# EAGLE design 5853-base-board (EAGLE 6.4)
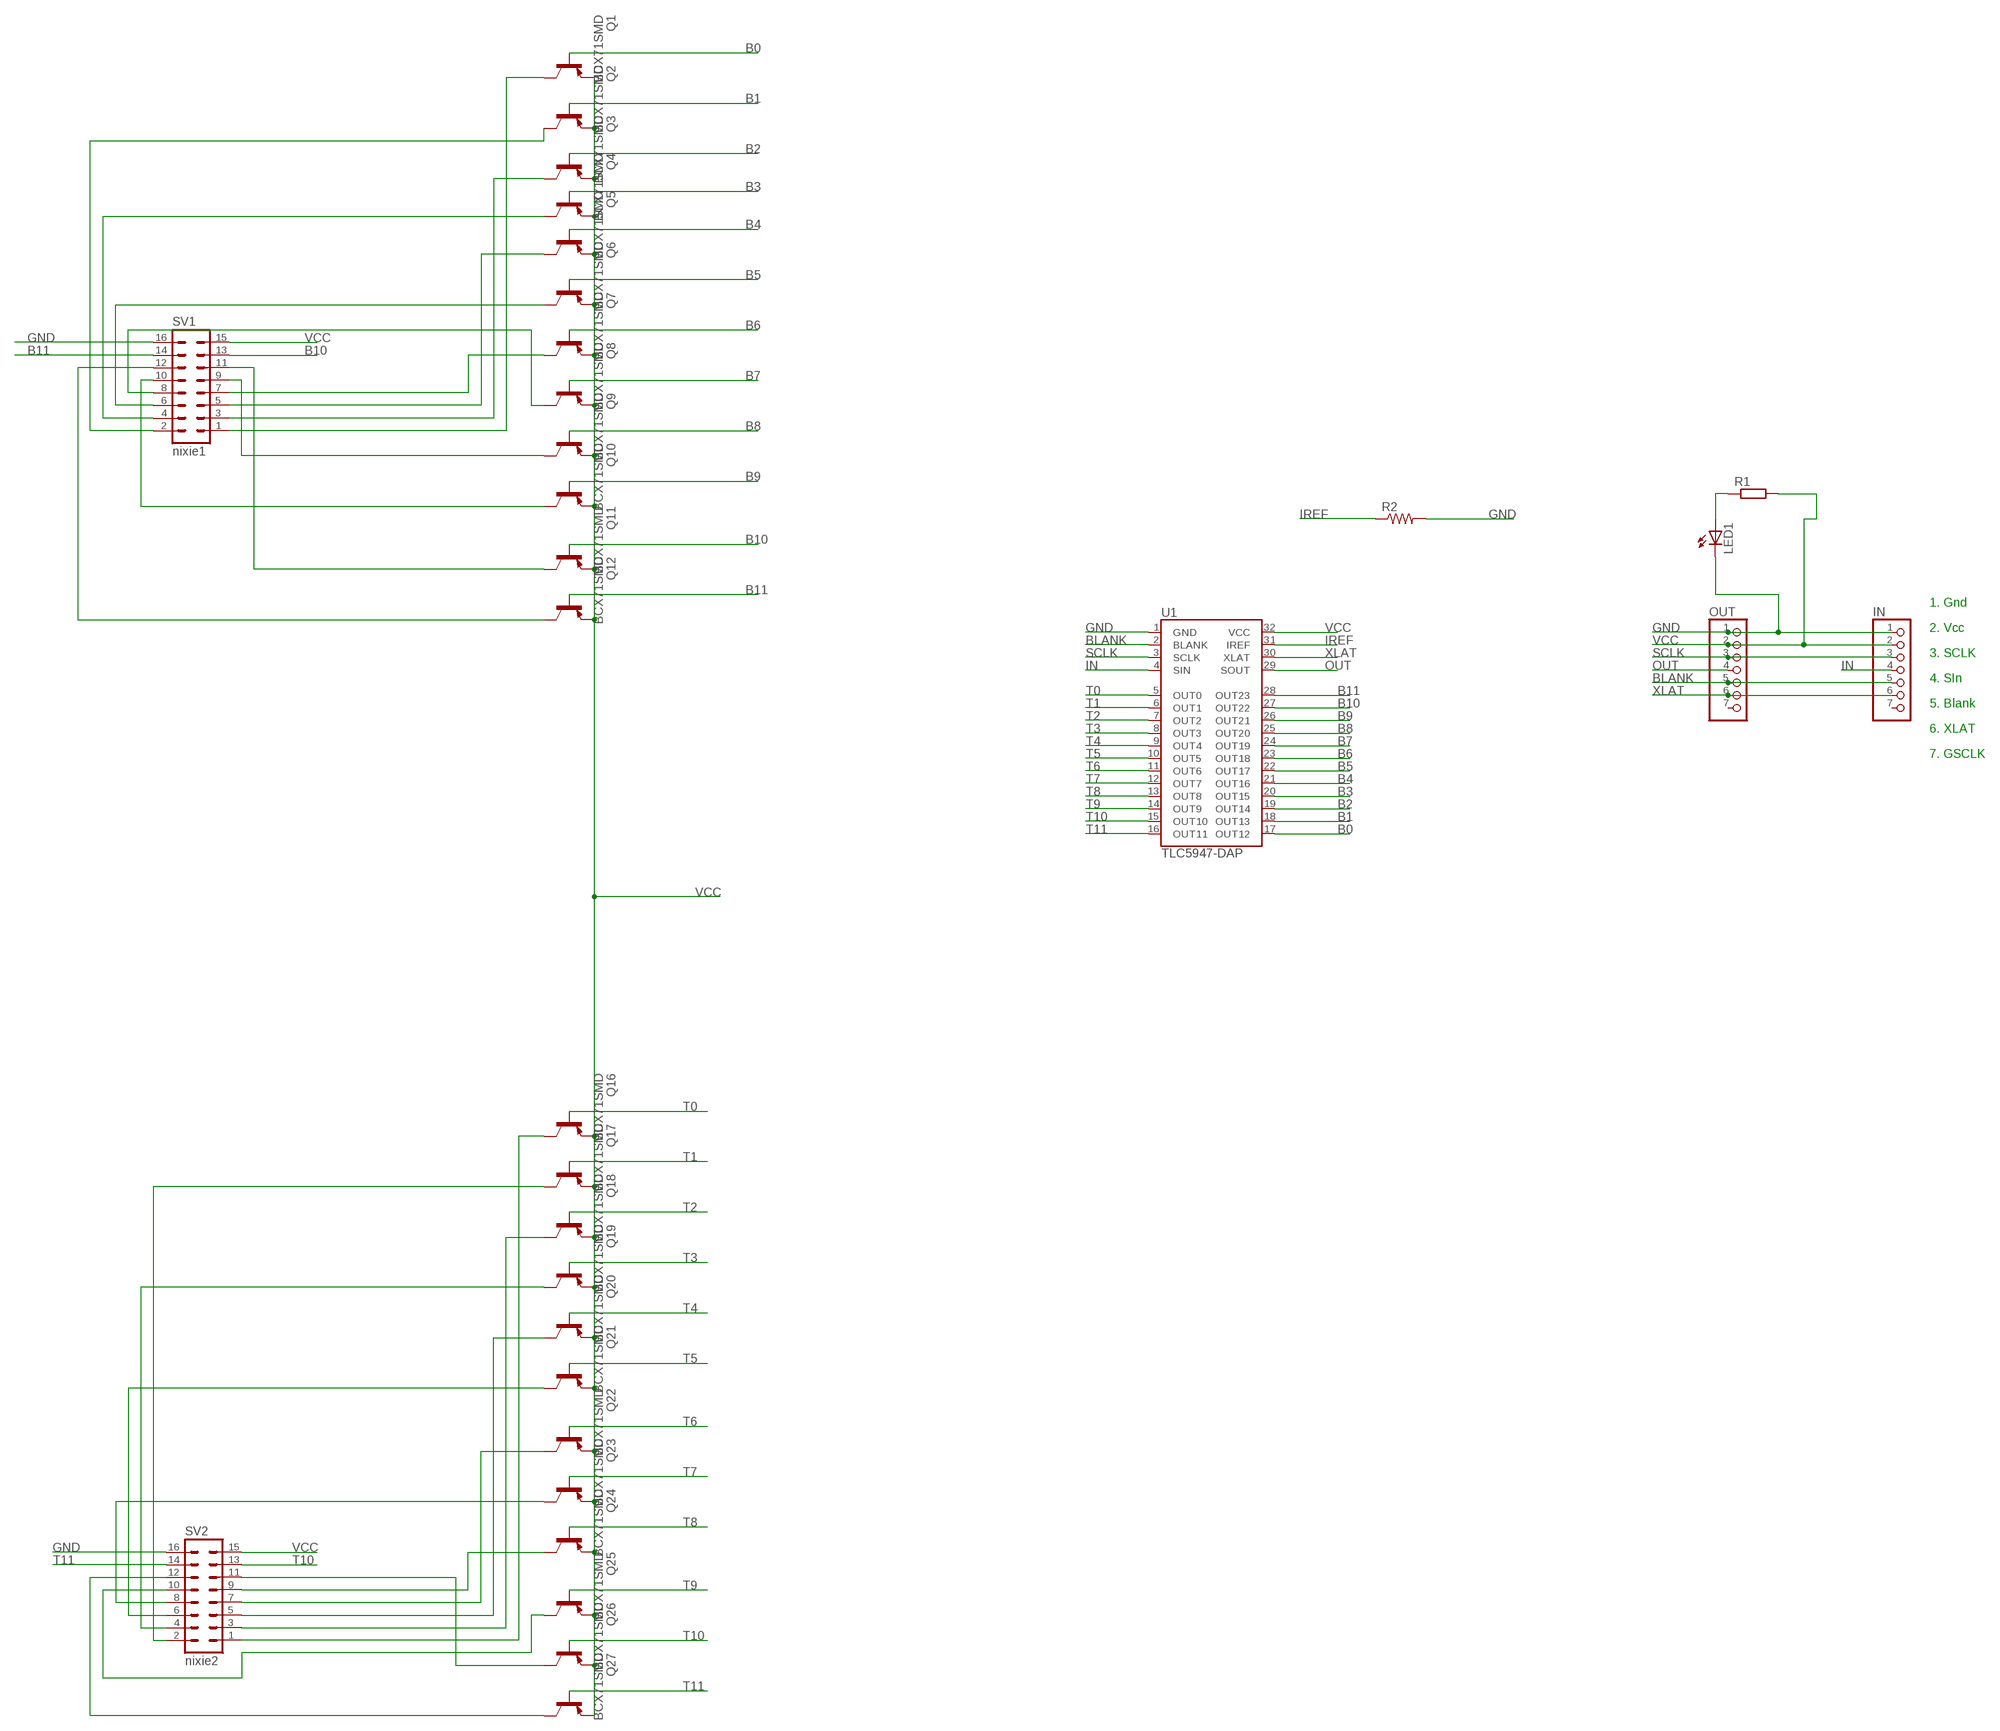
[diagram p0: schematic, sheet 1]

## Parts
IN  PINHD-1X7  [1X07]
LED1  LEDCHIPLED_0603  [CHIPLED_0603]
OUT  PINHD-1X7  [1X07]
Q1  BCX71SMD  [SOT23]
Q2  BCX71SMD  [SOT23]
Q3  BCX71SMD  [SOT23]
Q4  BCX71SMD  [SOT23]
Q5  BCX71SMD  [SOT23]
Q6  BCX71SMD  [SOT23]
Q7  BCX71SMD  [SOT23]
Q8  BCX71SMD  [SOT23]
Q9  BCX71SMD  [SOT23]
Q10  BCX71SMD  [SOT23]
Q11  BCX71SMD  [SOT23]
Q12  BCX71SMD  [SOT23]
Q16  BCX71SMD  [SOT23]
Q17  BCX71SMD  [SOT23]
Q18  BCX71SMD  [SOT23]
Q19  BCX71SMD  [SOT23]
Q20  BCX71SMD  [SOT23]
Q21  BCX71SMD  [SOT23]
Q22  BCX71SMD  [SOT23]
Q23  BCX71SMD  [SOT23]
Q24  BCX71SMD  [SOT23]
Q25  BCX71SMD  [SOT23]
Q26  BCX71SMD  [SOT23]
Q27  BCX71SMD  [SOT23]
R1  R-EU_M0805  [M0805]
R2  R-US_R0805W  [R0805W]
SV1  nixie1  ML16  [ML16]
SV2  nixie2  ML16  [ML16]
U1  TLC5947-DAP  [TSSOP32-GROUNDPAD]

## Nets
B0: Q1.1(B) U1.17(OUT12)
B1: Q2.1(B) U1.18(OUT13)
B2: Q3.1(B) U1.19(OUT14)
B3: Q4.1(B) U1.20(OUT15)
B4: Q5.1(B) U1.21(OUT16)
B5: Q6.1(B) U1.22(OUT17)
B6: Q7.1(B) U1.23(OUT18)
B7: Q8.1(B) U1.24(OUT19)
B8: Q9.1(B) U1.25(OUT20)
B9: Q10.1(B) U1.26(OUT21)
B10: Q11.1(B) SV1.13 U1.27(OUT22)
B11: Q12.1(B) SV1.14 U1.28(OUT23)
BLANK: IN.5 OUT.5 U1.2(BLANK)
GND: IN.1 LED1.C OUT.1 R2.2 SV1.16 SV2.16 U1.1(GND)
IN: IN.4 U1.4(SIN)
IREF: R2.1 U1.31(IREF)
N$49: LED1.A R1.1
N$74: Q1.3(C) SV1.1
N$75: Q2.3(C) SV1.2
N$76: Q3.3(C) SV1.3
N$77: Q4.3(C) SV1.4
N$78: Q5.3(C) SV1.5
N$79: Q6.3(C) SV1.6
N$80: Q7.3(C) SV1.7
N$81: Q8.3(C) SV1.8
N$82: Q9.3(C) SV1.9
N$83: Q10.3(C) SV1.10
N$84: Q11.3(C) SV1.11
N$85: Q12.3(C) SV1.12
N$89: Q16.3(C) SV2.1
N$90: Q17.3(C) SV2.2
N$91: Q18.3(C) SV2.3
N$92: Q19.3(C) SV2.4
N$93: Q20.3(C) SV2.5
N$94: Q21.3(C) SV2.6
N$95: Q22.3(C) SV2.7
N$96: Q23.3(C) SV2.8
N$97: Q24.3(C) SV2.9
N$98: Q25.3(C) SV2.10
N$99: Q26.3(C) SV2.11
N$100: Q27.3(C) SV2.12
OUT: OUT.4 U1.29(SOUT)
SCLK: IN.3 OUT.3 U1.3(SCLK)
T0: Q16.1(B) U1.5(OUT0)
T1: Q17.1(B) U1.6(OUT1)
T2: Q18.1(B) U1.7(OUT2)
T3: Q19.1(B) U1.8(OUT3)
T4: Q20.1(B) U1.9(OUT4)
T5: Q21.1(B) U1.10(OUT5)
T6: Q22.1(B) U1.11(OUT6)
T7: Q23.1(B) U1.12(OUT7)
T8: Q24.1(B) U1.13(OUT8)
T9: Q25.1(B) U1.14(OUT9)
T10: Q26.1(B) SV2.13 U1.15(OUT10)
T11: Q27.1(B) SV2.14 U1.16(OUT11)
VCC: IN.2 OUT.2 Q1.2(E) Q2.2(E) Q3.2(E) Q4.2(E) Q5.2(E) Q6.2(E) Q7.2(E) Q8.2(E) Q9.2(E) Q10.2(E) Q11.2(E) Q12.2(E) Q16.2(E) Q17.2(E) Q18.2(E) Q19.2(E) Q20.2(E) Q21.2(E) Q22.2(E) Q23.2(E) Q24.2(E) Q25.2(E) Q26.2(E) Q27.2(E) R1.2 SV1.15 SV2.15 U1.32(VCC)
XLAT: IN.6 OUT.6 U1.30(XLAT)
Unconnected: IN.7 OUT.7

## Notes on the sheet
- 1. Gnd
- 2. Vcc
- 3. SCLK
- 4. SIn
- 5. Blank
- 6. XLAT
- 7. GSCLK

## Library data of the parts
IN OUT = pinhead:PINHD-1X7: PIN HEADER
LED1 = led:LED: LED OSRAM: - CHIPLED LG R971, LG N971, LY N971, LG Q971, LY Q971, LO R971, LY R971 LH N974, LH R974 LS Q976, LO Q976, LY Q976 LO Q996 - Hyper CHIPLED LW Q18S LB Q993, LB Q99A, LB R99A - SideLED LS A670, LO A670, LY A670, LG A670, LP A670 LB A673, LV A673, LT A673, LW A673 LH A674 LY A675 LS A676, LA A676, LO A676, LY A676, LW A676 LS A679, LY A679, LG A679 - Hyper Micro SIDELED® LS Y876, LA Y876, LO Y876, LY Y876 LT Y87S - SmartLED LW L88C, LW L88S LB L89C, LB L89S, LG L890 LS L89K, LO L89K, LY L89K LS L896, LA L896, LO L896, LY L896 - TOPLED LS T670, LO T670, LY T670, LG T670, LP T670 LSG T670, LSP T670, LSY T670, LOP T670, LYG T670 LG T671, LOG T671, LSG T671 LB T673, LV T673, LT T673, LW T673 LH T674 LS T676, LA T676, LO T676, LY T676, LB T676, LH T676, LSB T676, LW T676 LB T67C, LV T67C, LT T67C, LS T67K, LO T67K, LY T67K, LW E67C LS E67B, LA E67B, LO E67B, LY E67B, LB E67C, LV E67C, LT E67C LW T67C LS T679, LY T679, LG T679 LS T770, LO T770, LY T770, LG T770, LP T770 LB T773, LV T773, LT T773, LW T773 LH T774 LS E675, LA E675, LY E675, LS T675 LS T776, LA T776, LO T776, LY T776, LB T776 LHGB T686 LT T68C, LB T68C - Hyper Mini TOPLED® LB M676 - Mini TOPLED Santana® LG M470 LS M47K, LO M47K, LY M47K Source: http://www.osram.convergy.de LUXEON: - LUMILED® LXK2-PW12-R00, LXK2-PW12-S00, LXK2-PW14-U00, LXK2-PW14-V00 LXK2-PM12-R00, LXK2-PM12-S00, LXK2-PM14-U00 LXK2-PE12-Q00, LXK2-PE12-R00, LXK2-PE12-S00, LXK2-PE14-T00, LXK2-PE14-U00 LXK2-PB12-K00, LXK2-PB12-L00, LXK2-PB12-M00, LXK2-PB14-N00, LXK2-PB14-P00, LXK2-PB14-Q00 LXK2-PR12-L00, LXK2-PR12-M00, LXK2-PR14-Q00, LXK2-PR14-R00 LXK2-PD12-Q00, LXK2-PD12-R00, LXK2-PD12-S00 LXK2-PH12-R00, LXK2-PH12-S00 LXK2-PL12-P00, LXK2-PL12-Q00, LXK2-PL12-R00 Source: www.luxeon.com KINGBRIGHT: KA-3528ASYC Source: www.kingbright.com
Q1-Q12 Q16-Q27 = transistor-pnp:BCX71SMD: PNP Transistor
R1 = resistor:R-EU_: RESISTOR, European symbol
R2 = resistor:R-US_: RESISTOR, American symbol
SV1 SV2 = con-ml:ML16: HARTING; OC_FARNELL: unknown; OC_NEWARK: unknown
U1 = tlc5947:TLC5947: TI TLC5947 24-Channel, 12-Bit PWM LED Driver with Internal Oscillator The TLC5947 is a 24-channel, constant current sink LED driver. Each channel is individually adjustable with 4096 pulse-width modulated (PWM) steps. PWM control is repeated automatically with the programmed grayscale (GS) data. GS data are written via a serial interface port. The current value of all 24 channels is set by a single external resistor. The TLC5947 has a thermal shutdown (TSD) function that turns off all output drivers during an over-temperature condition. All of the output drivers automatically restart when the temperature returns to normal conditions. Packages: HTSSOP-32 PowerPAD 32-pin 5x5mm QFN

## Board
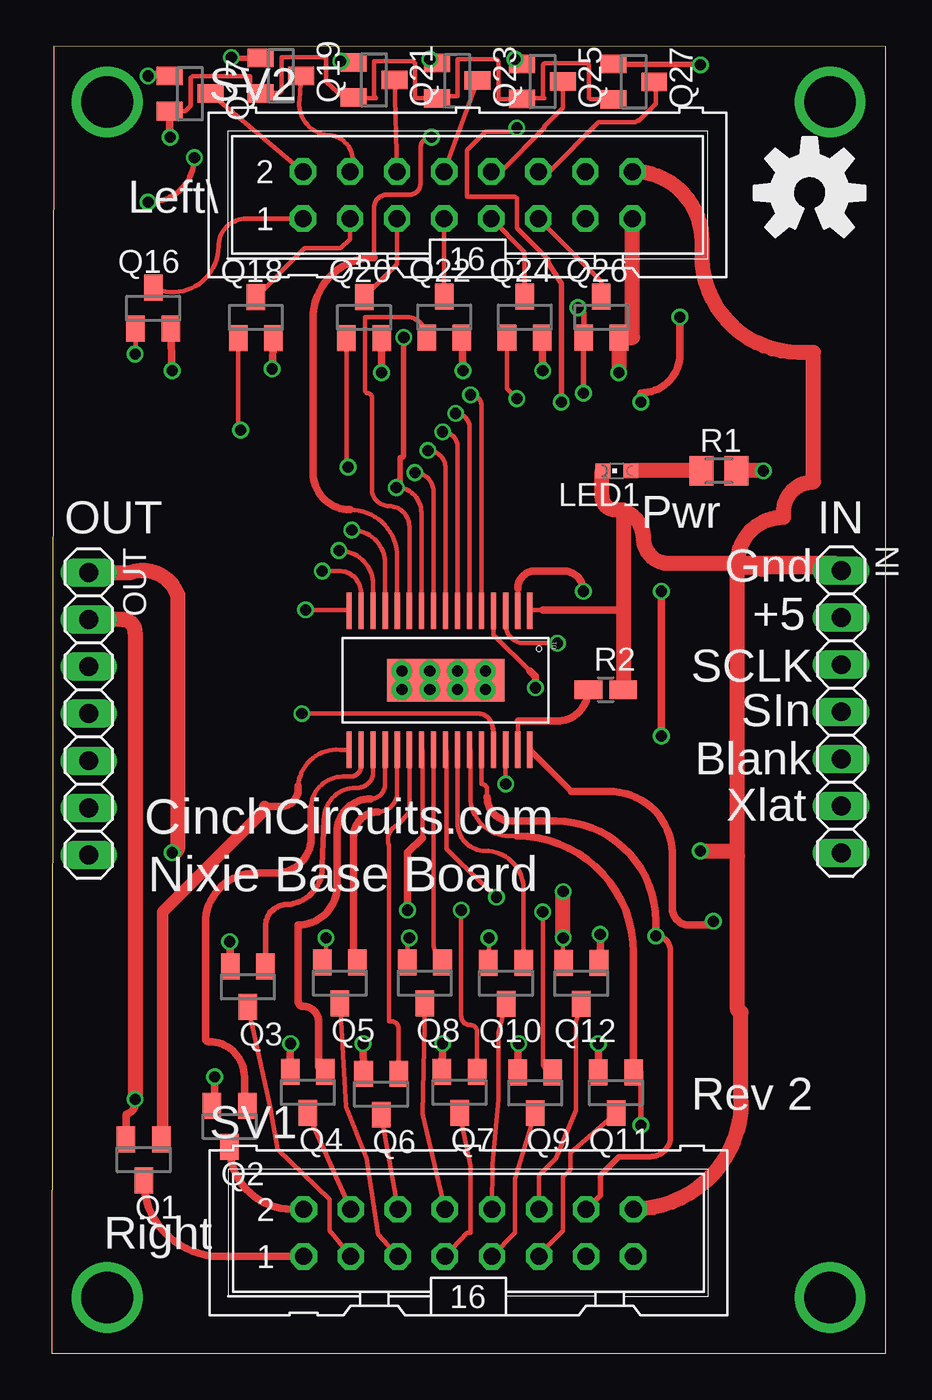
[diagram p1: board, top side]
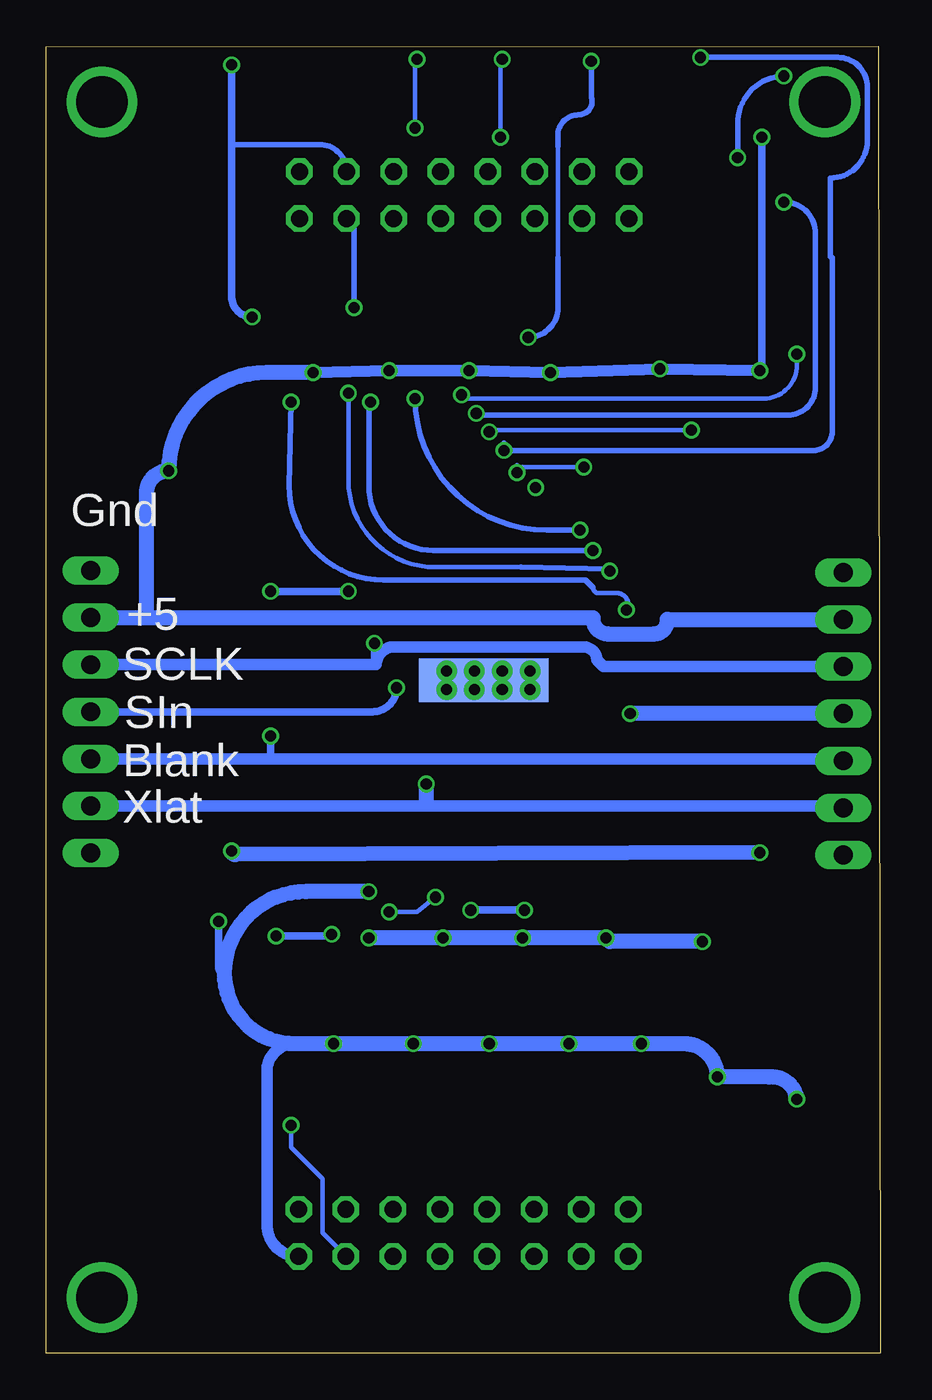
[diagram p2: board, bottom side, seen from below]

Size 45 x 70.5 mm. Coordinates in mm from the lower left corner, seen from the top.
Outline: 0,0 45,0 45,70.47 0.1,70.5 0,0
Copper layers (1*16): Top 0.035mm / dielectric 1.5mm / Bottom 0.035mm
Design rules "Fusion_eagle_rule_v1.1": minimum track width 6mil, minimum drill 12mil, track to track 6mil, track to pad 6mil, pad to pad 6mil, via to via 6mil, smd to smd 0mil, copper to edge 10mil, drill to drill 10mil, minimum pad ring 10mil, minimum via ring 6mil, stop-mask expansion 2mil, vias tented up to drill 100mil, thermal gap 10mil

### Footprints (pad centres in the part's own frame; a part is rotated, then mirrored left to right if it is on the bottom)
1X07 = drill 1.016 long: 1 -7.62,0; 2 -5.08,0; 3 -2.54,0; 4 0,0; 5 2.54,0; 6 5.08,0; 7 7.62,0
CHIPLED_0603 = smd 0.8 x 0.8: A 0,-0.75; C 0,0.75
SOT23 = smd 1 x 1.4: 1 -0.95,-1.1; 2 0.95,-1.1; 3 0,1.1
M0805 = smd 1.3 x 1.6: 1 -0.95,0; 2 0.95,0
R0805W = smd 1.5 x 1: 1 -0.94,0; 2 0.94,0
ML16 = drill 0.914 octagon: 1 -8.89,-1.27; 2 -8.89,1.27; 3 -6.35,-1.27; 4 -6.35,1.27; 5 -3.81,-1.27; 6 -3.81,1.27; 7 -1.27,-1.27; 8 -1.27,1.27; 9 1.27,-1.27; 10 1.27,1.27; 11 3.81,-1.27; 12 3.81,1.27; 13 6.35,-1.27; 14 6.35,1.27; 15 8.89,-1.27; 16 8.89,1.27
TSSOP32-GROUNDPAD = smd 1.981 x 0.279: 1 -3.75,3.9; 2 -3.75,3.25; 3 -3.75,2.6; 4 -3.75,1.95; 5 -3.75,1.3; 6 -3.75,0.65; 7 -3.75,0; 8 -3.75,-0.65; 9 -3.75,-1.3; 10 -3.75,-1.95; 11 -3.75,-2.6; 12 -3.75,-3.25; 13 -3.75,-3.9; 14 -3.75,-4.55; 15 -3.75,-5.2; 16 -3.75,-5.85; 17 3.75,-5.85; 18 3.75,-5.2; 19 3.75,-4.55; 20 3.75,-3.9; 21 3.75,-3.25; 22 3.75,-2.6; 23 3.75,-1.95; 24 3.75,-1.3; 25 3.75,-0.65; 26 3.75,0; 27 3.75,0.65; 28 3.75,1.3; 29 3.75,1.95; 30 3.75,2.6; 31 3.75,3.25; 32 3.75,3.9 | smd 2.286 x 6.35: 33 0,-0.63 | drill 0.6: P$1 -0.5,1.5; P$2 -0.5,0; P$3 -0.5,-1.5; P$4 0.5,1.5; P$5 0.5,0; P$6 0.5,-1.5; P$7 -0.5,-3; P$8 0.5,-3 | smd 2.35 x 7 bottom: P$9 0,-0.5

### Placement (x,y rotation side)
IN  42.6,34.6 270 top
LED1  30.5,47.6 90 top
OUT  2,34.5 270 top
Q1  4.97,10.43 180 top
Q2  9.6,12.23 180 top
Q3  10.59,19.77 180 top
Q4  13.82,14.07 180 top
Q5  15.55,19.97 180 top
Q6  17.78,13.97 180 top
Q7  22.01,14.07 180 top
Q8  20.14,19.97 180 top
Q9  26.09,14.05 180 top
Q10  24.52,19.95 180 top
Q11  30.45,14.05 180 top
Q12  28.58,19.95 180 top
Q16  5.48,56.37 0 top
Q17  7.47,67.95 270 top
Q18  11.02,55.87 0 top
Q19  12.37,68.91 270 top
Q20  16.86,55.87 0 top
Q21  17.39,68.69 270 top
Q22  21.18,55.89 0 top
Q23  21.89,68.65 270 top
Q24  25.52,55.89 0 top
Q25  26.49,68.61 270 top
Q26  29.66,55.89 0 top
Q27  31.41,68.59 270 top
R1  36,47.6 0 top
R2  29.9,35.8 0 top
SV1  22.49,6.49 0 top
SV2  22.45,62.48 0 top
U1  21.9,36.3 270 top

### Tracks (layer width: path | path; a pad name or v marks a point on that pad's centre or on a via)
B0
  Top 0.254: U1.17 15.55,32.55 arc90 13.3,30.6
  Top 0.406: 13.3,30.6 arc-90 12.5,29.5 11.5,29.5 | 5.9,11.55 arc90 Q1.1
  Top 0.61: 11.5,29.5 11.5,29.3 6,23.8 6,11.61 Q1.1
B1
  Top 0.254: U1.18 16.7,31.7 arc-90 16.1,31.1 15.7,31.1 arc90 14,29.4
  Top 0.406: Q2.1 arc-90 10.4,13.48 10.4,14.9 arc90 8.5,16.8 arc-90 8.3,17 8.3,23.2 arc-90 11,25.9 12.2,25.9 arc90 14,27.9 14,29.4
B2
  Top 0.254: U1.19 17.35,31.35 arc-90 16.5,30.5 16.4,30.5 arc90 14.7,28.8
  Top 0.305: 14.7,28.8 14.6,26.3 arc-90 12.7,24.2 arc90 11.54,23.04 Q3.1
B3
  Top 0.254: 17.2,29.9 arc90 18,30.7 U1.20
  Top 0.406: Q4.1 arc-90 14.4,15.54 14.4,17.9 arc90 13.6,18.7 arc-90 13.3,19 13.3,23.1 arc90 15.4,25.2 15.4,28.1 arc-90 17.2,29.9
B4
  Top 0.254: 17.6,29.2 arc90 18.65,30.25 U1.21
  Top 0.406: Q5.1 16.3,21.5 16.3,27.9 arc-90 17.6,29.2
B5
  Top 0.254: Q6.1 18.73,17.57 arc90 18.2,17.9 18.2,27.4 arc-90 18.7,28.5 19.3,29.2 U1.22
B6  (via drill 0.6)
  Top 0.254: U1.23 20,32.55 20,27.8 | v22.1,23.9 22.1,18.2 arc90 22.6,17.7 arc-90 22.96,17.34 Q7.1
  Top 0.406: v19.2,23.9 19.2,27 20,27.8
  Bottom 0.406: v19.2,23.9 v22.1,23.9
B7
  Top 0.254: U1.24 20.6,22.1 arc51 Q8.1
B8  (via drill 0.6)
  Top 0.254: Q9.1 arc-90 26.5,15.69 v26.5,23.8 | U1.25 21.3,32.5 21.3,27.2 22,26.5 v24,24.6
  Bottom 0.254: v24,24.6 25,23.8 v26.5,23.8
B9
  Top 0.254: Q10.1 25.47,25.03 arc90 23.4,27.1 arc-90 21.9,28.6 U1.26
B10  (via drill 0.6)
  Top 0.254: 25.1,27.9 24.7,27.9 arc-90 22.6,30 22.6,32.5 arc90 U1.27
  Top 0.305: Q11.1 31.8,15.15 v31.8,12.3
  Top 0.406: Q11.1 31.4,21.6 arc90 25.1,27.9
  Bottom 0.254: SV1.13 30.1,6.48 30.1,9.4 31.8,11.1 v31.8,12.3
B11  (via drill 0.6)
  Top 0.254: 23.5,30 23.5,30.4 arc90 23.2,30.7 U1.28
  Top 0.305: SV1.14 29.6,8.52 29.6,9.6 30.6,10.6 32.3,10.6 arc90 33.4,11.7 33.4,21.7 arc90 v32.6,22.5
  Top 0.406: Q12.1 arc90 29.6,21.12 v29.6,22.6 | v32.6,22.5 32.6,23.3 arc90 27.2,28.7 24.8,28.7 arc-90 23.5,30
  Bottom 0.406: v29.6,22.6 arc90 29.7,22.5 v32.6,22.5
BLANK  (via drill 0.6)
  Top 0.254: U1.2 25.15,41.25
  Top 0.406: 25.15,41.25 arc-90 26.1,42.2 27.6,42.2 arc-90 v28.7,41.1 | v32.9,41.1 v32.9,33.3
  Bottom 0.254: 32.9,32.06 arc90 33.5,32.06
  Bottom 0.406: v28.7,41.1 v32.9,41.1 | v32.9,33.3 32.9,32.06
  Bottom 0.61: IN.5 33.5,32.06 32.9,32.06 2,32.06 OUT.5
GND  (via drill 0.6)
  Top 0.254: U1.1 25.85,40.1 26.5,40.1
  Top 0.406: 26.5,40.1 30.84,40.1
  Top 0.813: IN.1 arc90 42.52,42.3 arc90 42.42,42.4 | LED1.C arc90 29.7,47.55 29.7,46.2 arc90 30.4,45.5 | 30.4,45.5 arc-90 31.94,43.96 arc90 33.3,42.6 37,42.6 | 38.3,42.3 38.2,42.4 | 37,26.8 37,18.6 arc90 37.2,18.4 37.2,13.58 arc-90 SV1.16 | 37,26.8 37,42.6 | 37,42.6 arc-90 39.5,45.1 39.5,45.4 arc-90 41.1,47 41.1,53.99 40.31,53.99 arc-90 35.1,59.2 35.1,59.99 arc90 SV2.16 | 42.42,42.4 38.2,42.4 | 42.42,42.4 arc90 42.22,42.6 37,42.6 | 37,42.6 arc90 37.2,42.4 38.2,42.4 | OUT.1 4.28,42.12 arc-90 6.8,40.9 6.8,27.3 arc-90 v6.5,27 | v35,27.1 36.7,27.1 arc-90 37,26.8 | 30.4,45.5 30.84,45.5 30.84,40.1 R2.2
  Bottom 0.813: v6.5,27 34.8,26.9 arc90 v35,27.1
IN  (via drill 0.6)
  Top 0.254: U1.4 23.85,38.75 25.8,36.8
  Top 0.406: 25.8,36.8 26.1,36.5 v26.1,35.9
  Bottom 0.406: v26.1,35.9 arc90 27.4,34.6 IN.4
IREF
  Top 0.254: U1.31 25.15,34.05 arc-90 25.2,34.1
  Top 0.406: 25.2,34.1 27.26,34.1 arc90 R2.1
N$14
  Top 0.2: 41.69,60.69 arc9 41.99,60.85 42.75,60.24 43.26,60.75 42.65,61.51 arc19 42.91,62.14 43.88,62.23 43.88,62.97 42.91,63.06 arc19 42.65,63.69 43.26,64.45 42.75,64.96 41.99,64.35 arc19 41.36,64.61 41.27,65.58 40.53,65.58 40.44,64.61 arc19 39.81,64.35 39.05,64.96 38.54,64.45 39.15,63.69 arc19 38.89,63.06 37.92,62.97 37.92,62.23 38.89,62.14 arc19 39.15,61.51 38.54,60.75 39.05,60.24 39.81,60.85 arc9 40.11,60.69 40.54,61.73 arc-68 39.96,62.6 arc-248 41.26,61.73 41.69,60.69
N$16  (via drill 2.8)
  other vias: 3,3
N$17  (via drill 2.8)
  other vias: 42,3
N$42  (via drill 2.8 pad 3.81)
  other vias: 3,67.5
N$47  (via drill 2.8 pad 3.81)
  other vias: 42,67.5
N$49
  Top 0.813: R1.1 LED1.A
N$74
  Top 0.406: Q1.3 arc90 9.08,5.22 SV1.1
N$75
  Top 0.406: SV1.2 12.97,7.76 arc-90 Q2.3
N$76
  Top 0.254: SV1.3 15.1,6.5 15,6.6 15,8.3 12.2,11 11.8,13.3 Q3.3
N$77
  Top 0.254: SV1.4 Q4.3
N$78
  Top 0.254: SV1.5 17.6,6.4 17,10.5 15.9,13.3 Q5.3
N$79
  Top 0.254: SV1.6 Q6.3
N$80
  Top 0.254: SV1.7 22.4,6.5 22.6,6.5 22.6,10.1 Q7.3
N$81
  Top 0.254: SV1.8 20,12.9 Q8.3
N$82
  Top 0.254: SV1.9 25,6.5 25,9.4 Q9.3
N$83
  Top 0.254: SV1.10 23.8,10.2 24.1,13.7 24.1,17.3 Q10.3
N$84
  Top 0.254: SV1.11 26.3,5.3 27.6,6.6 27.6,9.5 28,9.9 28,10.8 Q11.3
N$85
  Top 0.254: SV1.12 26.3,9.6 27.2,10.5 28.3,13.1 28.3,17.9 Q12.3
N$89
  Top 0.254: SV2.1 10.51,61.21 arc90 9,59.7 arc-115 Q16.3
N$90
  Top 0.254: Q17.3 SV2.2
N$91
  Top 0.254: SV2.3 16.1,60.1 15.6,59.6 13.65,59.6 Q18.3
N$92
  Top 0.254: Q19.3 13.37,67.63 arc90 14.9,65.7 arc-117 SV2.4
N$93
  Top 0.254: SV2.5 18.64,58.75 Q20.3
N$94
  Top 0.254: Q21.3 SV2.6
N$95
  Top 0.254: Q22.3 SV2.7
N$96
  Top 0.254: Q23.3 SV2.8
N$97
  Top 0.254: Q24.3 25.52,59.41 SV2.9
N$98
  Top 0.254: SV2.10 24.25,63.75 26.6,66.1 26.6,66.2 27.6,67.2 Q25.3
N$99
  Top 0.254: Q26.3 29.66,57.81 SV2.11
N$100
  Top 0.254: SV2.12 26.85,63.75 29.5,66.4 31.5,66.4 31.6,66.5 31.7,66.5 32.6,67.4 32.6,68.5 Q27.3
OUT  (via drill 0.6)
  Top 0.254: U1.29 23.85,33.7 23.8,33.7 arc90 23,34.5 v13.5,34.5
  Bottom 0.813: OUT.4 v13.5,34.5
SCLK  (via drill 0.6)
  Top 0.254: U1.3 24.5,39.3 arc90 25.5,38.3 v27.3,38.3
  Bottom 0.254: 27.3,37.24 arc-90 27.2,37.14
  Bottom 0.406: v27.3,38.3 27.3,37.24
  Bottom 0.61: IN.3 27.2,37.14 arc90 26.24,38.1 16,38.1 arc90 15.3,37.4 14.94,37.04 OUT.3 2,37.14
T0  (via drill 0.6)
  Top 0.254: U1.5 23.2,51.1 arc90 v22.6,51.7 | v4.5,53.9 arc90 4.53,53.93 Q16.1
  Bottom 0.254: v22.6,51.7 arc90 22.5,51.8 arc-90 22.2,51.5 6.3,51.5 arc-90 4.5,53.3 v4.5,53.9
T1  (via drill 0.6)
  Top 0.254: U1.6 22.55,49.95 arc90 v21.8,50.7
  Top 0.305: v5.2,62.1 5.3,62.1 arc90 v7.7,64.5 | v5.2,68.9 6.07,69.2 arc-90 Q17.1
  Bottom 0.254: v21.8,50.7 21.8,50.8 arc-90 21.9,50.9
  Bottom 0.305: 21.9,50.9 arc-90 21.6,50.6 5,50.6 arc-90 3.5,52.1 3.5,60.4 arc-90 v5.2,62.1 | v7.7,64.5 7.7,66.3 arc90 v5.2,68.9
T2  (via drill 0.6)
  Top 0.254: U1.7 21.9,48.9 arc90 v21.1,49.7 | v10.2,49.8 arc-90 10.07,49.93 Q18.1
  Bottom 0.254: v21.1,49.7 21.1,49.8 v10.2,49.8
T3  (via drill 0.6)
  Top 0.254: U1.8 21.25,47.75 arc90 v20.3,48.7
  Top 0.305: v9.7,69.9 arc90 9.74,69.86 Q19.1
  Bottom 0.254: v20.3,48.7 20.3,49.1
  Bottom 0.305: 20.3,49.1 arc-90 19.9,48.7 3.6,48.7 arc-90 2.6,49.7 2.6,59.1 arc90 2.7,59.2 2.7,63.4 arc-90 0.7,65.4 0.7,68.3 arc-90 2.3,69.9 v9.7,69.9
T4  (via drill 0.6)
  Top 0.254: U1.9 20.6,46.5 arc90 v19.6,47.5 | v16,47.8 arc-90 15.91,47.89 Q20.1
  Bottom 0.254: v19.6,47.5 19.6,47.9 arc-90 19.5,47.8 v16,47.8
T5  (via drill 0.6)
  Top 0.254: U1.10 19.95,45.35 arc90 v18.6,46.7
  Top 0.305: Q21.1 15.86,69.64 arc-90 v15.6,69.7 | v19,54.8 19,48.5 arc-90 18.8,48.3 18.8,46.9 arc-90 v18.6,46.7
  Bottom 0.254: v18.6,46.7 18.6,46.8 arc-90 18.7,46.9 | 17.4,65.1 17.4,59.1
  Bottom 0.305: v15.6,69.7 15.6,67.8 arc110 16.3,66.8 arc-90 17.4,65.7 17.4,65.1 | 17.4,59.1 17.4,56.4 arc90 v19,54.8
T6
  Top 0.254: U1.11 19.3,44.6 arc90 18.2,45.7 arc-101 17.3,46.8 17.3,51.5 arc90 17,51.8 16.9,51.9 16.9,55.9 19.12,55.9 arc-90 Q22.1
T7  (via drill 0.6)
  Top 0.254: U1.12 18.65,42.95 arc90 16.1,45.5 | 17.4,59.1 17.4,61.8 arc-90 18.1,62.5 19.3,62.5 arc90 19.9,63.1 19.9,65 arc-90 v20.5,65.6 | v20.4,69.8 20.59,69.7 arc-90 Q23.1
  Top 0.406: 16.1,45.5 arc-90 14.1,47.5 14.1,55.8 arc-90 17.4,59.1
  Bottom 0.254: v20.5,65.6 20.5,69.7 arc90 v20.4,69.8
T8  (via drill 0.6)
  Top 0.254: U1.13 18,42.6 arc90 v16.2,44.4 | v25.1,51.5 24.57,52.03 Q24.1
  Bottom 0.254: v16.2,44.4 16.2,44.5
  Bottom 0.305: v25.1,51.5 arc-90 18,44.4 v16.2,44.4
T9  (via drill 0.6)
  Top 0.254: U1.14 17.35,41.45 arc90 v15.5,43.3 | 26.8,58.8 26.8,59 25.1,60.7 25.1,62.3 25,62.4 22.4,62.4 22.4,64.9 23.4,65.9 24.9,65.9 v25.1,66.1 | v25,69.8 25,69.95 Q25.1
  Top 0.305: v27.5,51.3 27.5,57.7 26.8,58.8
  Bottom 0.254: v25.1,66.1 25.1,69.9 v25,69.8
  Bottom 0.305: v15.5,43.3 24.1,43.3 arc90 27.6,46.8 27.6,51.2 arc90 v27.5,51.3
T10  (via drill 0.6)
  Top 0.254: U1.15 16.7,41 arc90 15.5,42.2 v14.6,42.2
  Top 0.305: v28.7,51.8 Q26.1 arc-90 Q26.1 28.71,56.09 v28.4,56.4
  Bottom 0.254: v14.6,42.2 14.6,42.3 | 19.4,42.4 24,42.4 arc90 28.7,47.1 v28.7,51.8
  Bottom 0.305: 14.6,42.3 19.4,42.4 | v28.4,56.4 28.4,60.81 SV2.13
T11  (via drill 0.6)
  Top 0.254: U1.16 16,40.1 v13.7,40.1
  Top 0.305: v31.8,51.3 arc-90 31.8,51.8 | v35,69.5 arc90 34.96,69.54 Q27.1
  Top 0.406: 31.8,51.8 arc90 33.9,53.9 v33.9,55.9
  Bottom 0.254: v13.7,40.1 13.6,40.2 13.6,40.4 arc-90 14.2,41 15.2,41 arc90 15.5,41.3
  Bottom 0.305: 15.5,41.3 15.9,41.7 26.8,41.7 arc90 31.9,46.8 v31.8,51.3 | SV2.14 arc-90 30.25,65.2 35,65.2
  Bottom 0.406: v35,69.5 35,65.2 35,57 arc-90 v33.9,55.9
VCC  (via drill 0.6)
  Top 0.152: 2,40 OUT.2
  Top 0.254: Q17.2 7.2,67 7.5,67.3 7.5,68.8 7.6,68.9 10.7,68.9 10.7,68.03 Q19.2 11.31,68 12.3,68 12.4,68.1 12.4,69.9 14.8,69.9 14.8,68.6 15.76,67.74 Q21.2 16.33,67.7 17.5,67.7 17.4,67.8 17.4,69.7 19.5,69.7 19.6,69.6 19.6,67.7 Q23.2 20.89,67.8 21.9,67.8 21.9,69.8 24,69.8 24.1,69.7 24.1,67.6 24.16,67.66 Q25.2 25.43,67.7 26.6,67.7 26.5,67.8 26.5,69.5 26.6,69.6 28.9,69.6 29,69.5 29,67.7 29.06,67.64 Q27.2 | Q5.2 14.8,21.07 v14.8,22.4 | v19.3,22.4 19.19,22.4 Q8.2 | Q10.2 23.6,21.05 v23.6,22.4 | Q12.2 27.7,21.05 27.7,21.1 27.6,21.1 v27.6,22.4
  Top 0.305: U1.32 28.05,30.3
  Top 0.406: Q3.2 9.64,22.16 v9.6,22.2 | Q4.2 12.87,16.67 v12.9,16.7 | v8.8,14.9 8.8,13.48 arc-90 Q2.2 | Q1.2 4.02,12.88 arc90 v4.5,13.7 | Q6.2 v16.8,16.7 | Q7.2 v21.1,16.7 | Q9.2 v25.2,16.7 | Q11.2 v29.5,16.7 | Q16.2 v6.5,53 | v11.9,53.1 Q18.2 | Q20.2 v17.8,52.9 | Q22.2 v22.2,53 | Q24.2 v26.5,53 | Q17.2 6.37,65.63 arc90 v6.4,65.6 | 28.05,30.3 30,30.3 arc-90 33.5,27 33.5,24.1 arc90 34.3,23.1 35.5,23.1 arc90 v35.7,23.3
  Top 0.813: v30.6,52.9 Q26.2 31.34,54.79 SV2.15 | v27.6,22.4 v27.6,24.9 | v4.5,13.7 4.5,38.9 arc90 3.82,39.58 OUT.2 | v38.4,47.6 R1.2
  Bottom 0.406: 14.6,22.2 v14.8,22.4 | v6.4,65.6 6.4,53.1 arc90 v6.5,53 | v35.7,23.3 35.7,20.8 arc-90 35.4,20.5
  Bottom 0.61: v6.5,53 v11.9,53.1 v17.8,52.9 v22.2,53 v26.5,53 v30.6,52.9 | SV1.15 arc90 33.1,6.94 33.1,15.2 arc90 31.6,16.7
  Bottom 0.813: v9.6,22.2 14.6,22.2 | v14.8,22.4 v19.3,22.4 v23.6,22.4 v27.6,22.4 | v4.5,13.7 arc-90 6,14.9 v8.8,14.9 arc-90 10.6,16.7 v12.9,16.7 v16.8,16.7 v21.1,16.7 v25.2,16.7 v29.5,16.7 31.6,16.7 arc90 35.4,20.5 arc90 31,24.9 v27.6,24.9 | 39.6,39.68 15.5,39.68 15.5,39.6 arc-90 14.7,38.8 12.2,38.8 arc-90 11.5,39.5 11.5,39.6 arc-90 11.48,39.58 OUT.2 | 39.6,39.68 39.6,46.4 arc90 v38.4,47.6 arc90 33.1,52.9 v30.6,52.9 | IN.2 39.6,39.68
XLAT  (via drill 0.6)
  Top 0.254: U1.30 v24.5,30.7
  Bottom 0.254: 24.5,29.62 arc90 24.6,29.52
  Bottom 0.61: IN.6 24.6,29.52 2,29.52 OUT.6
  Bottom 0.813: v24.5,30.7 24.5,29.62

### Text on the board
tPlace: Left\ | OUT | Pwr | IN | Gnd | +5 | SCLK | SIn | Blank | Xlat | CinchCircuits.com | Nixie Base Board | Rev 2 | Right
bPlace: Gnd | +5 | SCLK | SIn | Blank | Xlat